# Altium schematic sheet M0_transfer_G3507.SchDoc
size A4
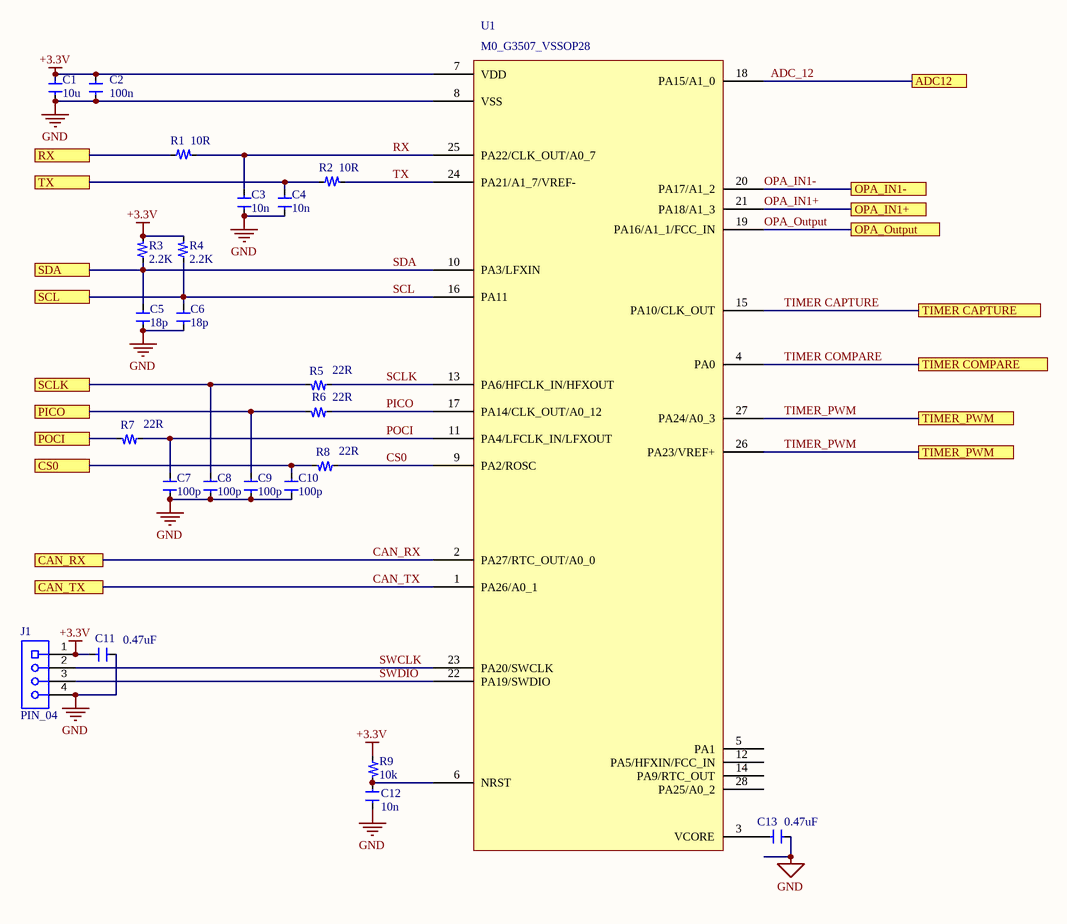
[diagram p0: M0_transfer_G3507.SchDoc]

## Parts
C1  value 10u  (hidden comment: C_0805)
C2  value 100n  (hidden comment: C_0805)
C3  value 10n  (hidden comment: C_0805)
C4  value 10n  (hidden comment: C_0805)
C5  value 18p  (hidden comment: C_0805)
C6  value 18p  (hidden comment: C_0805)
C7  value 100p  (hidden comment: C_0805)
C8  value 100p  (hidden comment: C_0805)
C9  value 100p  (hidden comment: C_0805)
C10  value 100p  (hidden comment: C_0805)
C11  value 0.47uF  (hidden comment: C_0805)
C12  value 10n  (hidden comment: C_0805)
C13  value 0.47uF  (hidden comment: C_0805)
J1  PIN_04
R1  value 10R  (hidden comment: R_0805)
R2  value 10R  (hidden comment: R_0805)
R3  value 2.2K  (hidden comment: R_0805)
R4  value 2.2K  (hidden comment: R_0805)
R5  value 22R  (hidden comment: R_0805)
R6  value 22R  (hidden comment: R_0805)
R7  value 22R  (hidden comment: R_0805)
R8  value 22R  (hidden comment: R_0805)
R9  value 10k  (hidden comment: R_0805)
U1  M0_G3507_VSSOP28  (net tie)

## Ports
ADC12, CAN_RX, CAN_TX, CS0, OPA_IN1+, OPA_IN1-, OPA_Output, PICO, POCI, RX, SCL, SCLK, SDA, TIMER CAPTURE, TIMER COMPARE, TIMER_PWM, TX

## Nets
+3.3V: C1.30 C2.30 C11.30 J1.1 R3.2 R4.2 R9.1 U1.7(VDD)
GND: C1.29 C2.29 C3.29 C4.29 C5.29 C6.29 C7.29 C8.29 C9.29 C10.29 C11.29 C12.30 C13.30 J1.4 U1.8(VSS)
ADC_12: U1.18(PA15/A1_0) ; port ADC12
CAN_RX: U1.2(PA27/RTC_OUT/A0_0) ; port CAN_RX
CAN_TX: U1.1(PA26/A0_1) ; port CAN_TX
CS0: R8.1 U1.9(PA2/ROSC)
CS0: C10.30 R8.2 ; port CS0  [a separate net that carries the same name]
OPA_IN1+: U1.21(PA18/A1_3) ; port OPA_IN1+
OPA_IN1-: U1.20(PA17/A1_2) ; port OPA_IN1-
OPA_Output: U1.19(PA16/A1_1/FCC_IN) ; port OPA_Output
PICO: R6.1 U1.17(PA14/CLK_OUT/A0_12)
PICO: C9.30 R6.2 ; port PICO  [a separate net that carries the same name]
POCI: C7.30 R7.1 U1.11(PA4/LFCLK_IN/LFXOUT)
POCI: R7.2 ; port POCI  [a separate net that carries the same name]
RX: C3.30 R1.2 U1.25(PA22/CLK_OUT/A0_7)
RX: R1.1 ; port RX  [a separate net that carries the same name]
SCL: C6.30 R4.1 U1.16(PA11) ; port SCL
SCLK: R5.1 U1.13(PA6/HFCLK_IN/HFXOUT)
SCLK: C8.30 R5.2 ; port SCLK  [a separate net that carries the same name]
SDA: C5.30 R3.1 U1.10(PA3/LFXIN) ; port SDA
SWCLK: J1.2 U1.23(PA20/SWCLK)
SWDIO: J1.3 U1.22(PA19/SWDIO)
TIMER CAPTURE: U1.15(PA10/CLK_OUT) ; port TIMER CAPTURE
TIMER COMPARE: U1.4(PA0) ; port TIMER COMPARE
TIMER_PWM: U1.26(PA23/VREF+) U1.27(PA24/A0_3) ; port TIMER_PWM
TX: R2.2 U1.24(PA21/A1_7/VREF-)
TX: C4.30 R2.1 ; port TX  [a separate net that carries the same name]
NetC12_29: C12.29 R9.2 U1.6(NRST)
NetC13_29: C13.29 U1.3(VCORE)

Not connected (* = marked no-connect by the designer): U1 5(PA1) 12(PA5/HFXIN/FCC_IN) 14(PA9/RTC_OUT) 28(PA25/A0_2)

## Library data of the parts
C1-C13 = C_0805: Capacitance
J1 = PIN_04: Connector
R1-R9 = R_0805: Resistor
U1 = M0_G3507_VSSOP28: VSSOP28  [7.1 mm × 3 mm]